# EAGLE design slave_01 (EAGLE 5.08)
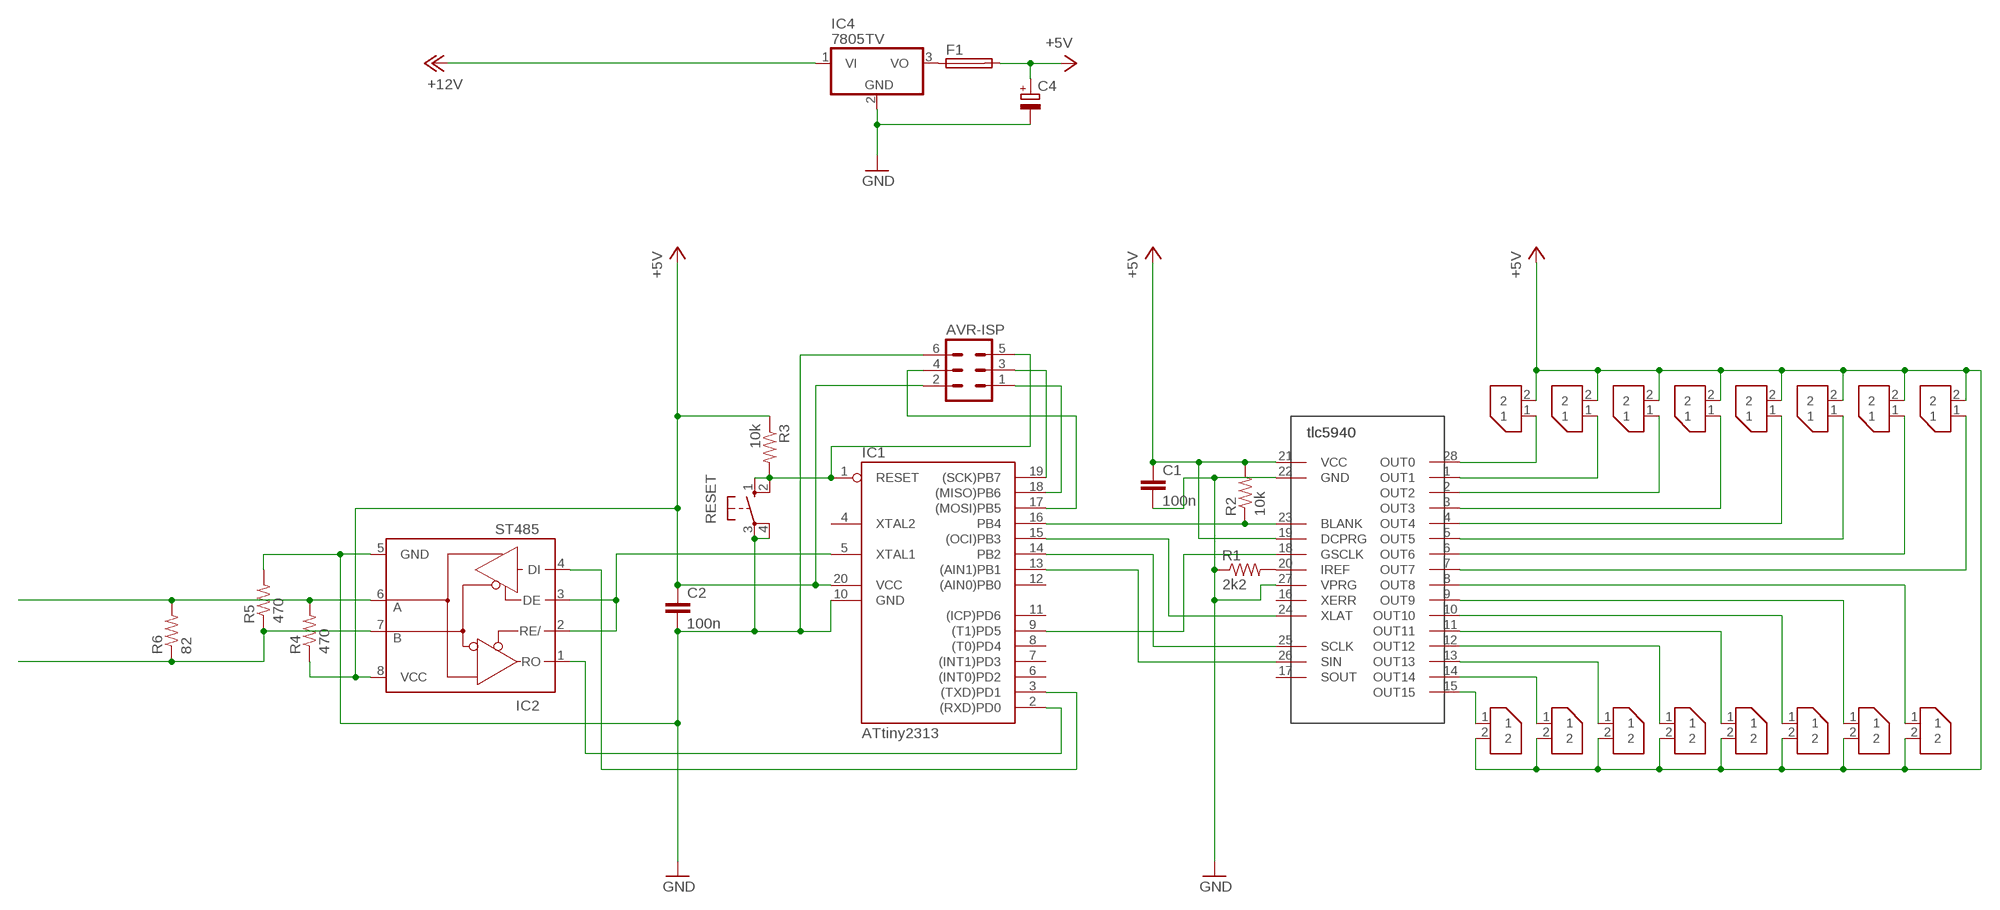
[diagram p0: schematic, sheet 1]

## Parts
AVR-ISP  MA03-2  [MA03-2]
C1  100n  C-EU050-025X075  [C050-025X075]
C2  100n  C-EU050-025X075  [C050-025X075]
C4  CPOL-EUE5-5  [E5-5]
F1  SH22,5A  [SH22,5A]
IC1  ATtiny2313  AT90S2313P  [DIL20]
IC2  ST485  MAX3468CPA  [DIL08]
IC4  7805TV  [TO220V]
R1  2k2  R-US_0204/7  [0204/7]
R2  10k  R-US_0204/7  [0204/7]
R3  10k  R-US_0204/5  [0204/5]
R4  470  R-US_0204/5  [0204/5]
R5  470  R-US_0204/5  [0204/5]
R6  82  R-US_0204/5  [0204/5]
RESET  10-XX  [B3F-10XX]
U$1  TLC5940-NT  [28-DIL-300]
U$2  SPOX-22-03-5025  [SPOX-22-03-5025]
U$3  SPOX-22-03-5025  [SPOX-22-03-5025]
U$4  SPOX-22-03-5025  [SPOX-22-03-5025]
U$5  SPOX-22-03-5025  [SPOX-22-03-5025]
U$6  SPOX-22-03-5025  [SPOX-22-03-5025]
U$7  SPOX-22-03-5025  [SPOX-22-03-5025]
U$8  SPOX-22-03-5025  [SPOX-22-03-5025]
U$9  SPOX-22-03-5025  [SPOX-22-03-5025]
U$10  SPOX-22-03-5025  [SPOX-22-03-5025]
U$11  SPOX-22-03-5025  [SPOX-22-03-5025]
U$12  SPOX-22-03-5025  [SPOX-22-03-5025]
U$13  SPOX-22-03-5025  [SPOX-22-03-5025]
U$14  SPOX-22-03-5025  [SPOX-22-03-5025]
U$15  SPOX-22-03-5025  [SPOX-22-03-5025]
U$16  SPOX-22-03-5025  [SPOX-22-03-5025]
U$17  SPOX-22-03-5025  [SPOX-22-03-5025]

## Nets
+5V: AVR-ISP.2 C1.1 C2.1 C4.+ F1.2 IC1.20(VCC) IC2.8(VCC) R2.2 R3.1 R4.1 U$1.19(DCPRG) U$1.21(VCC) U$2.2 U$3.2 U$4.2 U$5.2 U$6.2 U$7.2 U$8.2 U$9.2 U$10.2 U$11.2 U$12.2 U$13.2 U$14.2 U$15.2 U$16.2 U$17.2
+12V: IC4.1(VI)
GND: AVR-ISP.6 C1.2 C2.2 C4.- IC1.10(GND) IC2.5(GND) IC4.2(GND) R1.1 R5.2 RESET.3(P) RESET.4(P1) U$1.22(GND) U$1.27(VPRG)
N$1: IC1.15((OCI)PB3) U$1.24(XLAT)
N$2: IC1.16(PB4) R2.1 U$1.23(BLANK)
N$3: IC1.9((T1)PD5) U$1.18(GSCLK)
N$4: IC1.14(PB2) U$1.25(SCLK)
N$5: IC1.13((AIN1)PB1) U$1.26(SIN)
N$6: R1.2 U$1.20(IREF)
N$7: IC1.5(XTAL1) IC2.2(RE/) IC2.3(DE)
N$8: AVR-ISP.1 IC1.18((MISO)PB6)
N$9: IC1.3((TXD)PD1) IC2.4(DI)
N$10: IC1.2((RXD)PD0) IC2.1(RO)
N$11: AVR-ISP.3 IC1.19((SCK)PB7)
N$12: F1.1 IC4.3(VO)
N$13: U$1.28(OUT0) U$2.1
N$14: AVR-ISP.4 IC1.17((MOSI)PB5)
N$15: U$1.1(OUT1) U$3.1
N$16: U$1.2(OUT2) U$4.1
N$17: U$1.3(OUT3) U$5.1
N$18: U$1.15(OUT15) U$10.1
N$19: U$1.14(OUT14) U$11.1
N$20: U$1.13(OUT13) U$12.1
N$21: U$1.12(OUT12) U$13.1
N$22: U$1.11(OUT11) U$14.1
N$23: U$1.10(OUT10) U$15.1
N$24: U$1.9(OUT9) U$16.1
N$25: U$1.8(OUT8) U$17.1
N$26: U$1.4(OUT4) U$6.1
N$27: U$1.5(OUT5) U$7.1
N$28: U$1.6(OUT6) U$8.1
N$29: U$1.7(OUT7) U$9.1
N$30: IC2.6(A) R4.2 R6.2
N$31: AVR-ISP.5 IC1.1(RESET) R3.2 RESET.1(S) RESET.2(S1)
N$32: IC2.7(B) R5.1 R6.1
Unconnected: IC1.4(XTAL2) IC1.6((INT0)PD2) IC1.7((INT1)PD3) IC1.8((T0)PD4) IC1.11((ICP)PD6) IC1.12((AIN0)PB0) U$1.16(XERR) U$1.17(SOUT)

## Library data of the parts
AVR-ISP = con-lstb:MA03-2: PIN HEADER
C1 C2 = resistor:C-EU: CAPACITOR, European symbol
C4 = resistor:CPOL-EU: POLARIZED CAPACITOR, European symbol
F1 = fuse:SH22,5A: FUSE HOLDER grid 22,5mm, isolated cap OGN0031 8201, Schurter (Buerklin)
IC1 = atmel:AT90S2313: MICROCONTROLLER 2 Kbytes FLASH 128 bytes SRAM 128 bytes EEPROM UART
IC2 = maxim:MAX34*: +5V, Fail-Safe, 40Mbps, Profibus RS-485/RS-422 Transceivers Source: MAX3465-MAX3469.pdf
IC4 = linear:78*: Positive VOLTAGE REGULATOR Source: http://cache.national.com/ds/LM/LM78L05.pdf http://www.fairchildsemi.com/ds/LM/LM7805.pdf
R1-R6 = resistor:R-US_: RESISTOR, American symbol
RESET = switch-omron:10-XX: OMRON SWITCH
U$1 = TLC5490:TLC5940-NT
U$2-U$17 = damians_bits:SPOX-22-03-5025: SPOX 22-03-5025

## Board
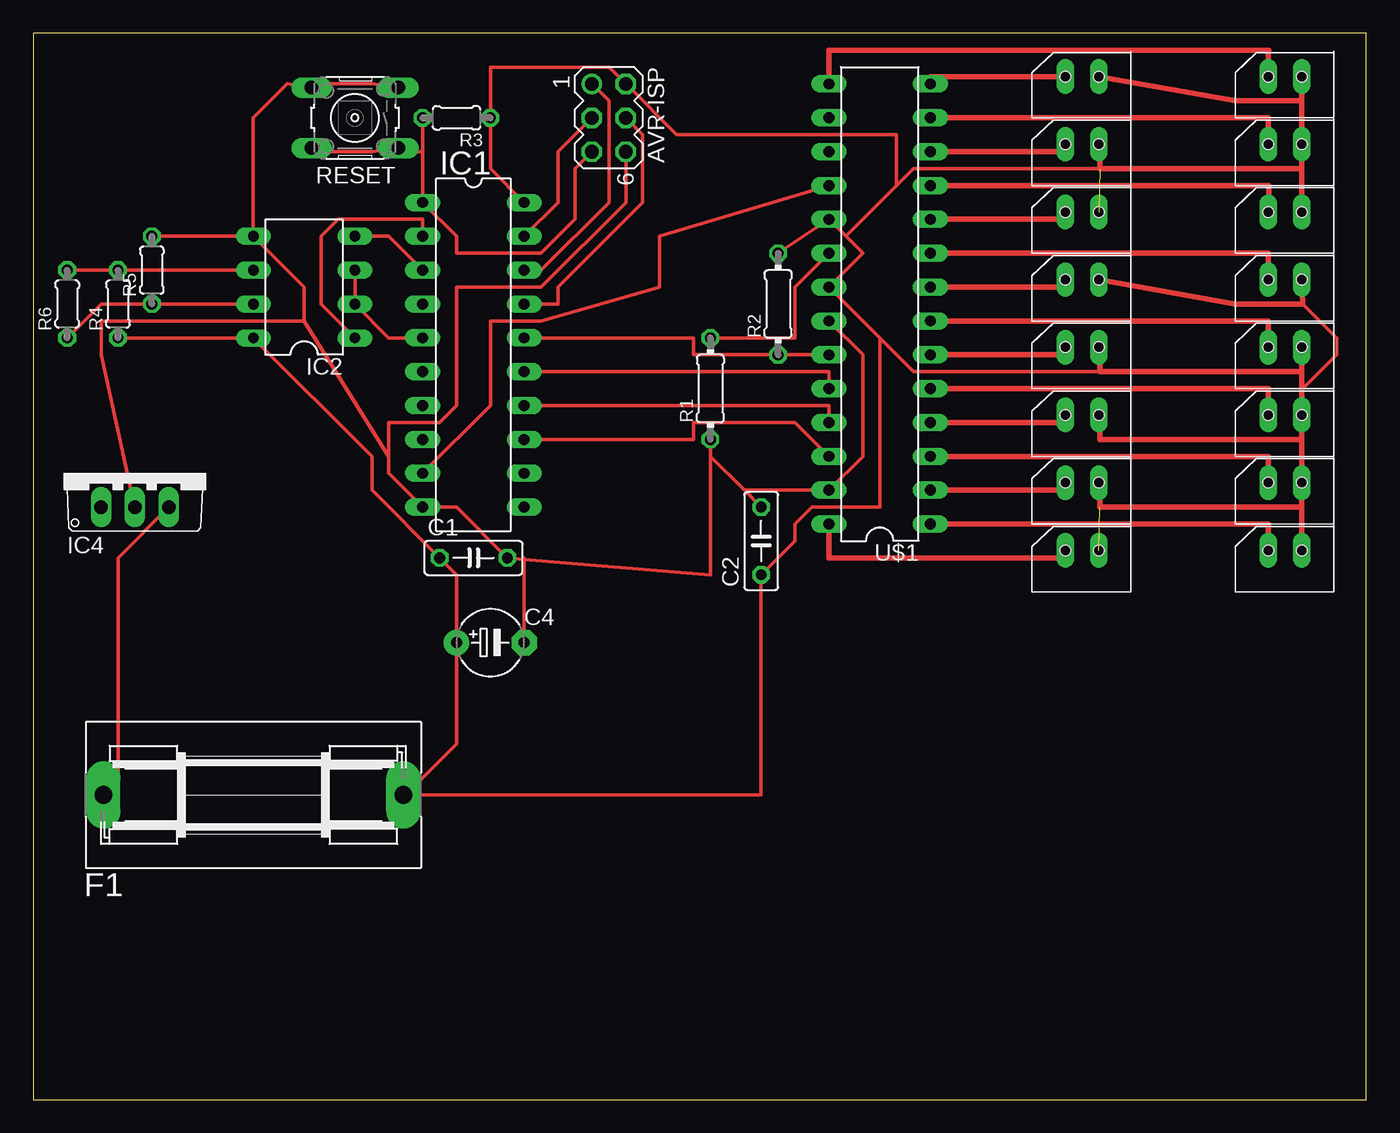
[diagram p1: board, top side]

Size 100 x 80 mm. Coordinates in mm from the lower left corner, seen from the top.
Outline: 0,0 100,0 100,80 0,80 0,0
Copper layers (1*16): Top 0.035mm / dielectric 1.5mm / Bottom 0.035mm
Design rules "default": minimum track width 10mil, minimum drill 24mil, track to track 8mil, track to pad 8mil, pad to pad 8mil, via to via 8mil, smd to smd 8mil, copper to edge 40mil, drill to drill 8mil, minimum pad ring 10mil, minimum via ring 8mil, stop-mask expansion 4mil, vias tented up to drill 0mil, thermal gap 10mil

### Footprints (pad centres in the part's own frame; a part is rotated, then mirrored left to right if it is on the bottom)
MA03-2 = drill 1.016 round: 1 -2.54,-1.27 | drill 1.016 octagon: 2 -2.54,1.27; 3 0,-1.27; 4 0,1.27; 5 2.54,-1.27; 6 2.54,1.27
C050-025X075 = drill 0.813 octagon: 1 -2.54,0; 2 2.54,0
E5-5 = drill 0.813 pad 1.905 round: + -2.54,0 | drill 0.813 pad 1.905 octagon: - 2.54,0
SH22,5A = drill 1.321 pad 2.54 long: 1 -11.252,0; 2 11.252,0
DIL20 = drill 0.813 long: 1 -11.43,-3.81; 2 -8.89,-3.81; 3 -6.35,-3.81; 4 -3.81,-3.81; 5 -1.27,-3.81; 6 1.27,-3.81; 7 3.81,-3.81; 8 6.35,-3.81; 9 8.89,-3.81; 10 11.43,-3.81; 11 11.43,3.81; 12 8.89,3.81; 13 6.35,3.81; 14 3.81,3.81; 15 1.27,3.81; 16 -1.27,3.81; 17 -3.81,3.81; 18 -6.35,3.81; 19 -8.89,3.81; 20 -11.43,3.81
DIL08 = drill 0.813 long: 1 -3.81,-3.81; 2 -1.27,-3.81; 3 1.27,-3.81; 4 3.81,-3.81; 5 3.81,3.81; 6 1.27,3.81; 7 -1.27,3.81; 8 -3.81,3.81
TO220V = drill 1.016 long: 1 -2.54,-2.54; 2 0,-2.54; 3 2.54,-2.54
0204/7 = drill 0.813 octagon: 1 -3.81,0; 2 3.81,0
0204/5 = drill 0.813 octagon: 1 -2.54,0; 2 2.54,0
B3F-10XX = drill 1.016 long: 1 -3.251,2.261; 2 3.251,2.261; 3 -3.251,-2.261; 4 3.251,-2.261
28-DIL-300 = drill 0.813 long: 1 -15.24,-3.81; 2 -12.7,-3.81; 3 -10.16,-3.81; 4 -7.62,-3.81; 5 -5.08,-3.81; 6 -2.54,-3.81; 7 0,-3.81; 8 2.54,-3.81; 9 5.08,-3.81; 10 7.62,-3.81; 11 10.16,-3.81; 12 12.7,-3.81; 13 15.24,-3.81; 14 17.78,-3.81; 15 17.78,3.81; 16 15.24,3.81; 17 12.7,3.81; 18 10.16,3.81; 19 7.62,3.81; 20 5.08,3.81; 21 2.54,3.81; 22 0,3.81; 23 -2.54,3.81; 24 -5.08,3.81; 25 -7.62,3.81; 26 -10.16,3.81; 27 -12.7,3.81; 28 -15.24,3.81
SPOX-22-03-5025 = drill 0.8 long: 1 2.5,3.1; 2 5,3.1 | hole 0.8: 2.5,3.1; 5,3.1

### Placement (x,y rotation side)
AVR-ISP  43.18,73.66 270 top
C1  33.02,40.64 0 top
C2  54.61,41.91 90 top
C4  34.29,34.29 0 top
F1  16.51,22.86 0 top
IC1  33.02,55.88 270 top
IC2  20.32,60.96 90 top
IC4  7.62,46.99 0 top
R1  50.8,53.34 90 top
R2  55.88,59.69 90 top
R3  31.75,73.66 180 top
R4  6.35,59.69 90 top
R5  8.89,62.23 90 top
R6  2.54,59.69 90 top
RESET  24.13,73.66 180 top
U$1  63.5,58.42 90 top
U$2  74.93,38.1 0 top
U$3  90.17,38.1 0 top
U$4  74.93,43.18 0 top
U$5  90.17,43.18 0 top
U$6  74.93,48.26 0 top
U$7  90.17,48.26 0 top
U$8  74.93,53.34 0 top
U$9  90.17,53.34 0 top
U$10  90.17,73.66 0 top
U$11  74.93,73.66 0 top
U$12  90.17,68.58 0 top
U$13  74.93,68.58 0 top
U$14  90.17,63.5 0 top
U$15  74.93,63.5 0 top
U$16  90.17,58.42 0 top
U$17  74.93,58.42 0 top

### Tracks (layer width: path | path; a pad name or v marks a point on that pad's centre or on a via)
+5V  (2 unrouted)
  Top 0.254: R2.2 U$1.19 60.96,64.77 | R4.1 IC2.8 25.4,48.26 25.4,45.72 C1.1 31.75,39.37 C4.+ 31.75,26.67 27.94,22.86 | IC1.20 34.29,69.85 R3.1 34.29,77.47 43.18,77.47 AVR-ISP.2 48.26,72.39 64.77,72.39 64.77,68.58 | 60.96,64.77 62.23,63.5 U$1.21 63.5,57.15 | 64.77,68.58 66.04,69.85 80.01,69.85 | 60.96,64.77 64.77,68.58 | 63.5,57.15 66.04,54.61 80.01,54.61 | 95.25,59.69 97.79,57.15 97.79,55.88 95.25,53.34 95.17,53.34 | 63.5,57.15 63.5,44.45 58.42,44.45 57.15,43.18 57.15,41.91 C2.1 54.61,22.86 27.94,22.86 | F1.2 27.94,22.86
  Top 0.406: 95.17,69.85 U$14.2 | 95.17,69.85 U$12.2 95.17,74.93 | 95.17,54.61 95.17,53.34 U$7.2 95.17,49.53 | 95.17,54.61 U$9.2 | 95.17,49.53 U$5.2 95.17,44.45 | 95.17,44.45 U$3.2 | U$13.2 80.01,71.68 80.01,69.85 95.17,69.85 | U$8.2 80.01,56.44 80.01,54.61 95.17,54.61 | U$6.2 80.01,51.36 80.01,49.53 95.17,49.53 | U$4.2 80.01,46.28 80.01,44.45 95.17,44.45 | 95.17,74.93 U$10.2 | U$11.2 90.17,74.93 95.17,74.93 | U$17.2 90.17,59.69 95.25,59.69 U$16.2
GND
  Top 0.254: IC2.5 16.51,73.66 19.05,76.2 RESET.4 20.32,76.2 25.4,76.2 RESET.3 | U$1.22 62.23,55.88 62.23,48.26 U$1.27 53.34,45.72 | IC2.5 R5.2 | AVR-ISP.6 44.45,67.31 38.1,60.96 31.75,60.96 31.75,52.07 30.48,50.8 26.67,50.8 26.67,48.26 | 26.67,48.26 26.67,46.99 IC1.10 31.75,44.45 C1.2 36.82,40.53 | IC2.5 20.32,60.96 20.32,58.42 | 20.32,58.42 26.67,48.26 | 20.32,58.42 5.08,58.42 5.08,55.88 IC4.2 | 50.8,48.26 53.34,45.72 | 53.34,45.72 C2.2 | 50.8,48.26 R1.1 | 36.82,40.53 50.8,39.37 50.8,48.26 | C4.- 36.83,40.64 36.82,40.53
N$1
  Top 0.254: IC1.15 59.69,54.61 U$1.24
N$2
  Top 0.254: U$1.23 R2.1 49.53,55.88 49.53,57.15 IC1.16
N$3
  Top 0.254: IC1.9 34.29,52.07 34.29,58.42 38.1,58.42 46.99,60.96 46.99,64.77 U$1.18
N$4
  Top 0.254: IC1.14 59.69,52.07 U$1.25
N$5
  Top 0.254: IC1.13 49.53,49.53 49.53,50.8 57.15,50.8 U$1.26
N$6
  Top 0.254: R1.2 57.15,57.15 57.15,60.96 U$1.20
N$7
  Top 0.254: IC2.3 IC2.2 26.67,57.15 IC1.5
N$8
  Top 0.254: IC1.18 38.1,62.23 43.18,67.31 43.18,74.93 AVR-ISP.1
N$9
  Top 0.254: IC2.4 26.67,64.77 IC1.3
N$10
  Top 0.254: IC2.1 21.59,59.69 21.59,64.77 22.86,66.04 29.21,66.04 IC1.2
N$11
  Top 0.254: IC1.19 39.37,67.31 39.37,71.12 AVR-ISP.3
N$12
  Top 0.254: IC4.3 6.35,40.64 6.35,22.86 F1.1
N$13
  Top 0.406: U$1.28 59.69,40.64 77.43,40.64 | 77.43,40.64 77.47,40.64 | 77.43,40.64 U$2.1
N$14
  Top 0.254: IC1.17 39.37,59.69 39.37,60.96 45.72,67.31 45.72,72.39 AVR-ISP.4
N$15
  Top 0.406: U$1.1 92.67,43.18 U$3.1
N$16
  Top 0.406: U$1.2 77.43,45.72 U$4.1
N$17
  Top 0.406: U$1.3 92.67,48.26 U$5.1
N$18
  Top 0.406: U$1.15 59.69,78.74 92.67,78.74 | 92.67,78.74 92.71,78.74 | 92.67,78.74 U$10.1
N$19
  Top 0.406: U$11.1 67.31,76.76 U$1.14
N$20
  Top 0.406: U$1.13 92.67,73.66 U$12.1
N$21
  Top 0.406: U$1.12 77.43,71.12 U$13.1
N$22
  Top 0.406: U$1.11 92.71,68.58 92.71,67.31 92.67,67.31 U$14.1
N$23
  Top 0.406: U$1.10 77.43,66.04 U$15.1
N$24
  Top 0.406: U$1.9 92.67,63.5 U$16.1
N$25
  Top 0.406: U$1.8 77.43,60.96 U$17.1
N$26
  Top 0.406: U$1.4 77.43,50.8 U$6.1
N$27
  Top 0.406: U$1.5 92.67,53.34 U$7.1
N$28
  Top 0.406: U$1.6 77.43,55.88 U$8.1
N$29
  Top 0.406: U$1.7 92.67,58.42 U$9.1
N$30
  Top 0.254: R6.2 R4.2 IC2.6
N$31
  Top 0.254: RESET.2 20.32,71.12 25.4,71.12 RESET.1 26.67,71.12 29.21,71.12 | 29.21,71.12 IC1.1 31.75,64.77 31.75,63.5 38.1,63.5 40.64,66.04 40.64,69.85 AVR-ISP.5 | 29.21,71.12 R3.2
N$32
  Top 0.254: R6.1 5.08,59.69 R5.1 IC2.7